# Altium project FMRadio.PrjPcb
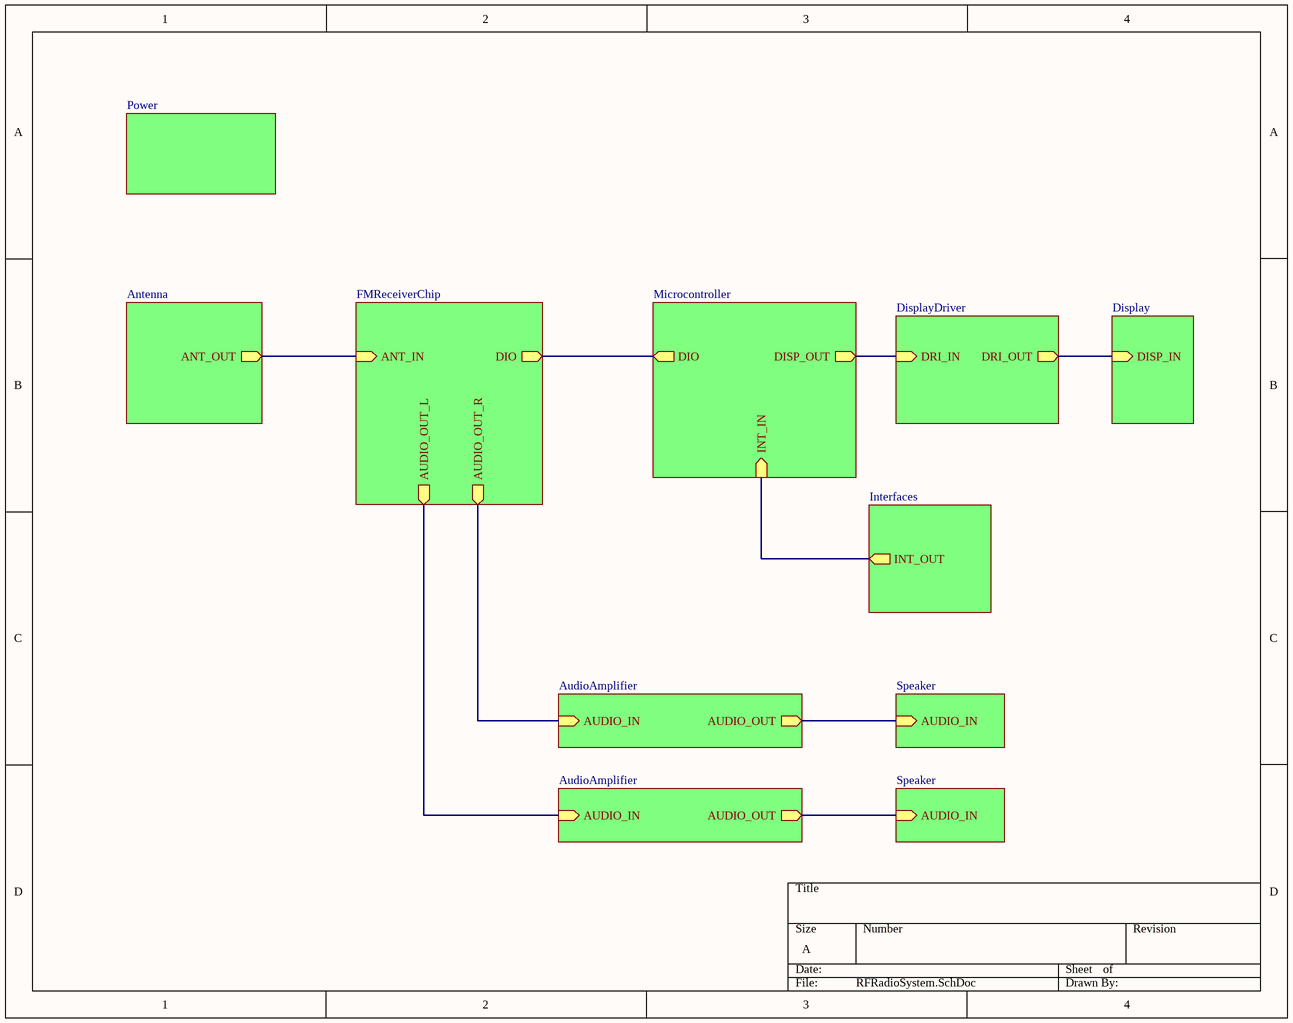
[diagram p0: RFRadioSystem.SchDoc]
6 sheets, 5 parts. Net scope: hierarchical (ports join the sheet entries above them; power ports are global).
Sheets:
  RFRadioSystem.SchDoc
  Antenna.SchDoc
  FMRecieverChip.SchDoc
  LowNoiseAmp.SchDoc
  MatchingNetwork.SchDoc
  Microcontroller.SchDoc

## Sheet RFRadioSystem.SchDoc
size A; SheetNumber: 1; SheetTotal: 6

### Sub-sheets
Antenna = File Name (file not in this document): ANT_OUT (out)
AudioAmplifier = File Name (file not in this document): AUDIO_OUT (out), AUDIO_IN (in)
AudioAmplifier = File Name (file not in this document): AUDIO_OUT (out), AUDIO_IN (in)
Display = File Name (file not in this document): DISP_IN (in)
DisplayDriver = File Name (file not in this document): DRI_OUT (out), DRI_IN (in)
FMReceiverChip = File Name (file not in this document): DIO (out), AUDIO_OUT_R (out), AUDIO_OUT_L (out), ANT_IN (in)
Interfaces = File Name (file not in this document): INT_OUT (out)
Microcontroller = File Name (file not in this document): DIO (out), DISP_OUT (out), INT_IN (in)
Power = File Name (file not in this document): no entries
Speaker = File Name (file not in this document): AUDIO_IN (in)
Speaker = File Name (file not in this document): AUDIO_IN (in)

### Nets
(unnamed): sheet FMReceiverChip/DIO, sheet Microcontroller/DIO
(unnamed): sheet FMReceiverChip/AUDIO_OUT_R, sheet AudioAmplifier/AUDIO_IN
(unnamed): sheet FMReceiverChip/AUDIO_OUT_L, sheet AudioAmplifier/AUDIO_IN
(unnamed): sheet FMReceiverChip/ANT_IN, sheet Antenna/ANT_OUT
(unnamed): sheet AudioAmplifier/AUDIO_OUT, sheet Speaker/AUDIO_IN
(unnamed): sheet AudioAmplifier/AUDIO_OUT, sheet Speaker/AUDIO_IN
(unnamed): sheet Microcontroller/DISP_OUT, sheet DisplayDriver/DRI_IN
(unnamed): sheet Microcontroller/INT_IN, sheet Interfaces/INT_OUT
(unnamed): sheet DisplayDriver/DRI_OUT, sheet Display/DISP_IN

## Sheet Antenna.SchDoc
size A; SheetNumber: 2; SheetTotal: 2
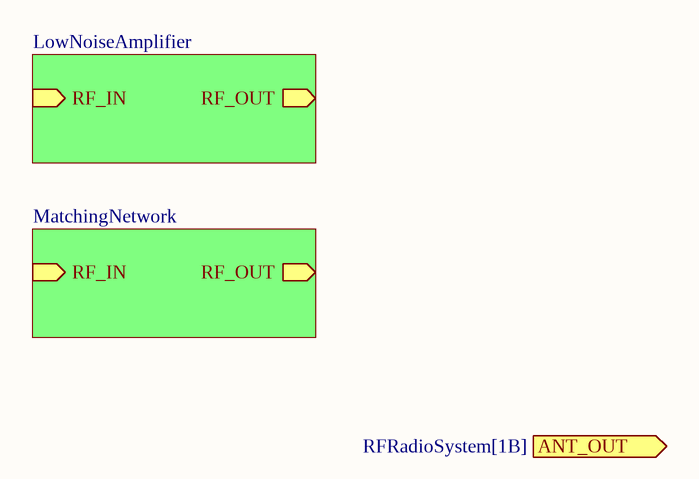
[diagram p1: Antenna.SchDoc]

### Sub-sheets
LowNoiseAmplifier = File Name (file not in this document): RF_OUT (out), RF_IN (in)
MatchingNetwork = File Name (file not in this document): RF_IN (in), RF_OUT (out)

### Ports
ANT_OUT (out, see RFRadioSystem[1B])

## Sheet FMRecieverChip.SchDoc
size A; SheetNumber: 3; SheetTotal: 3
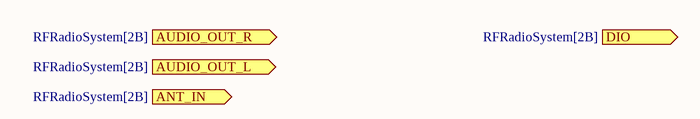
[diagram p2: FMRecieverChip.SchDoc]

### Ports
ANT_IN (in, see RFRadioSystem[2B]), AUDIO_OUT_L (out, see RFRadioSystem[2B]), AUDIO_OUT_R (out, see RFRadioSystem[2B]), DIO (out, see RFRadioSystem[2B])

## Sheet LowNoiseAmp.SchDoc
size A; SheetNumber: 4; SheetTotal: 4
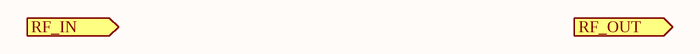
[diagram p3: LowNoiseAmp.SchDoc]

### Ports
RF_IN (in), RF_OUT (out)

## Sheet MatchingNetwork.SchDoc
size A; SheetNumber: 5; SheetTotal: 5
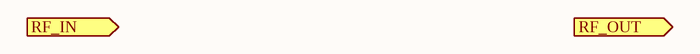
[diagram p4: MatchingNetwork.SchDoc]

### Ports
RF_IN (in), RF_OUT (out)

## Sheet Microcontroller.SchDoc
size A; SheetNumber: 6; SheetTotal: 6
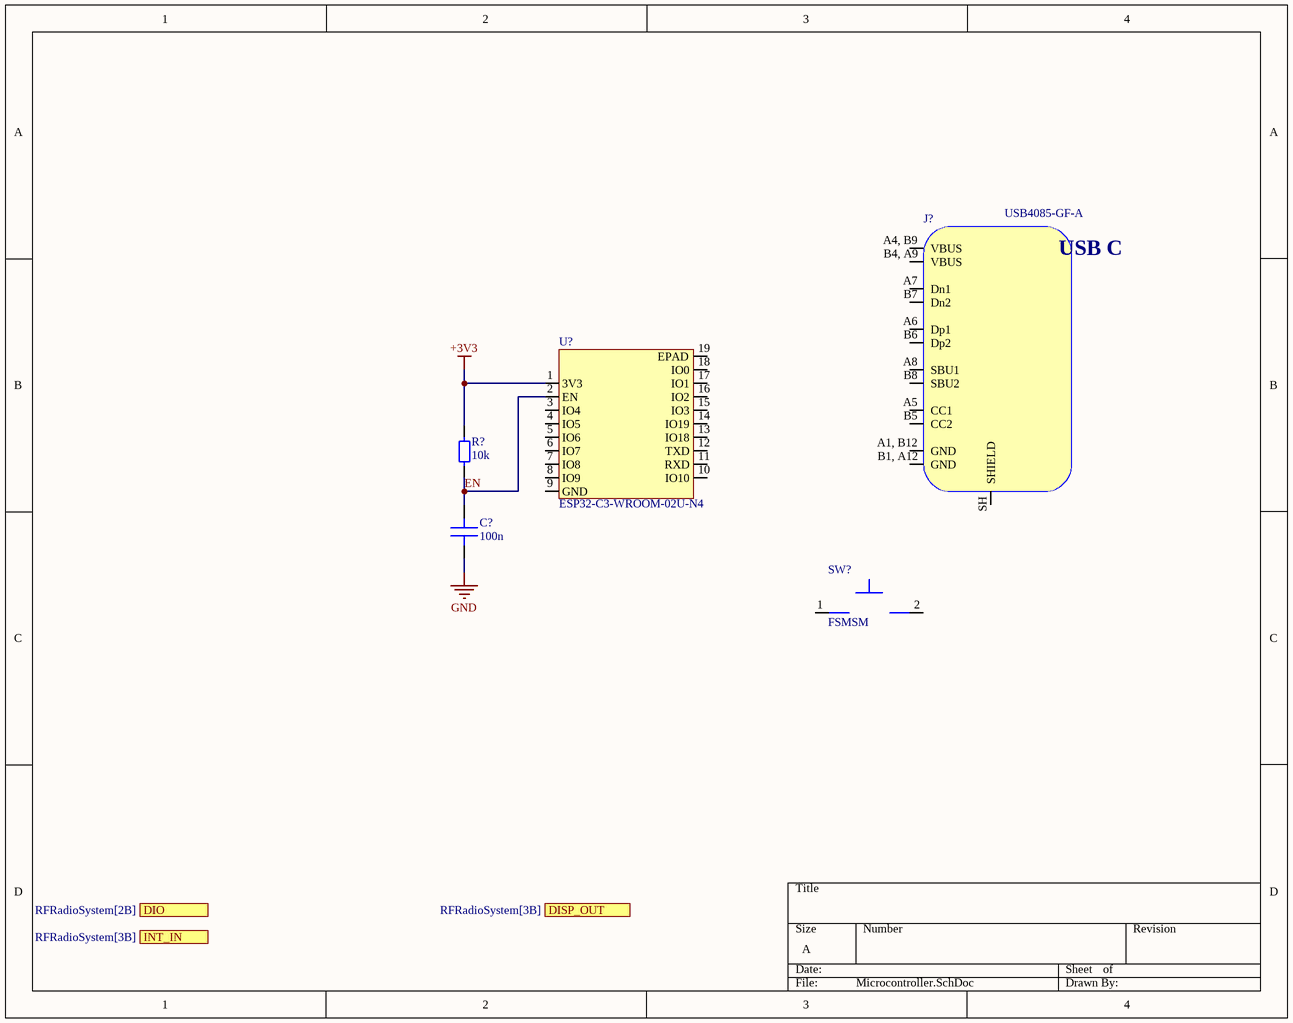
[diagram p5: Microcontroller.SchDoc]

### Parts
C?  100n  [CAP_0603(M)]
J?  USB4085-GF-A
R?  10k  [RES_0603(M)]
SW?  FSMSM  [FSMSM]
U?  ESP32-C3-WROOM-02U-N4  [ESP32-C3-WROOM-02U-N4]

### Ports
DIO (out, see RFRadioSystem[2B]), DISP_OUT (out, see RFRadioSystem[3B]), INT_IN (in, see RFRadioSystem[3B])

### Nets
+3V3: R?.2 U?.1(3V3)
GND: C?.1
EN: C?.2 R?.1 U?.2(EN)

Not connected (* = marked no-connect by the designer): J? A1, B12(GND) A4, B9(VBUS) A5(CC1) A6(Dp1) A7(Dn1) A8(SBU1) B1, A12(GND) B4, A9(VBUS) B5(CC2) B6(Dp2) B7(Dn2) B8(SBU2) SH(SHIELD); SW? 1 2; U? 3(IO4) 4(IO5) 5(IO6) 6(IO7) 7(IO8) 8(IO9) 9(GND) 10(IO10) 11(RXD) 12(TXD) 13(IO18) 14(IO19) 15(IO3) 16(IO2) 17(IO1) 18(IO0) 19(EPAD)

### Notes on the sheet
- (in symbol USB4085-GF-A) USB C

### Library data of the parts
C? = CAP_0603_16V: Capacitor SMD 0603 16V
J? = USB4085-GF-A: USB Connectors USB Type C, 2.0, Rec, TH , G/F, RA , Top Mnt, T & R
R? = RES_0603: Resistor SMD 0603
SW? = FSMSM: SWITCH TACTILE SPST-NO 0.05A 24V
U? = ESP32-C3-WROOM-02U-N4: Bluetooth, WiFi 802.11b/g/n, Bluetooth v5.0 Transceiver Module 2.4GHz Antenna Not Included, U.FL Surface Mount